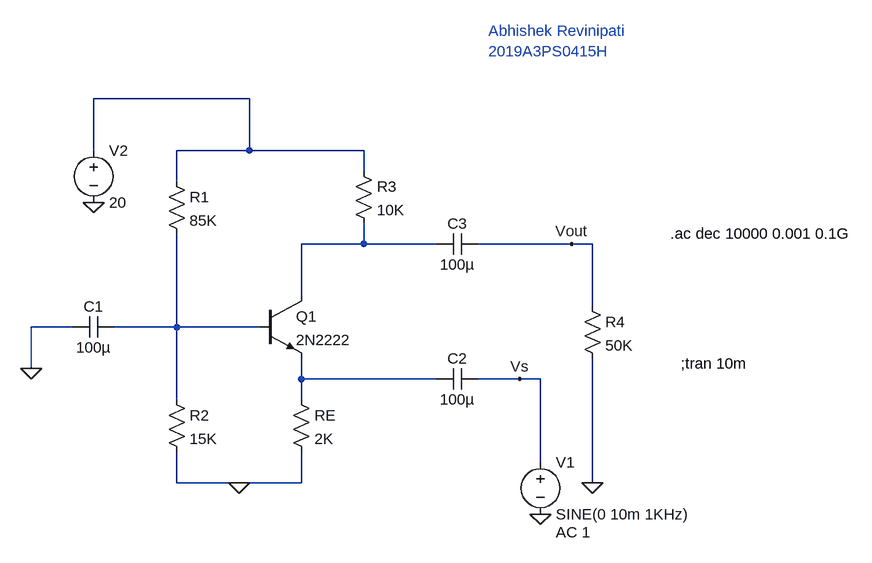
[diagram p0: schematic 2019A3PS0415H_CB_Amp.asc]
2019A3PS0415H_CB_Amp.asc, the LTspice schematic file:
Version 4
SHEET 1 1056 680
WIRE 112 -176 -128 -176
WIRE -128 -96 -128 -176
WIRE 112 -96 112 -176
WIRE 112 -96 0 -96
WIRE 288 -96 112 -96
WIRE 288 -64 288 -96
WIRE 0 -48 0 -96
WIRE 288 48 288 16
WIRE 288 48 192 48
WIRE 400 48 288 48
WIRE 608 48 464 48
WIRE 640 48 608 48
WIRE 192 128 192 48
WIRE 640 144 640 48
WIRE -160 176 -224 176
WIRE 0 176 0 32
WIRE 0 176 -96 176
WIRE 128 176 0 176
WIRE -224 240 -224 176
WIRE 192 256 192 224
WIRE 400 256 192 256
WIRE 528 256 464 256
WIRE 560 256 528 256
WIRE 0 288 0 176
WIRE 192 288 192 256
WIRE 560 384 560 256
WIRE 0 416 0 368
WIRE 96 416 0 416
WIRE 192 416 192 368
WIRE 192 416 96 416
WIRE 640 416 640 224
FLAG 96 416 0
FLAG -128 -16 0
FLAG 560 464 0
FLAG 640 416 0
FLAG -224 240 0
FLAG 528 256 Vs
FLAG 608 48 Vout
SYMBOL npn 128 128 R0
SYMATTR InstName Q1
SYMATTR Value 2N2222
SYMBOL res -16 -64 R0
SYMATTR InstName R1
SYMATTR Value 85K
SYMBOL res -16 272 R0
SYMATTR InstName R2
SYMATTR Value 15K
SYMBOL res 176 272 R0
SYMATTR InstName RE
SYMATTR Value 2K
SYMBOL cap -96 160 R90
WINDOW 0 0 32 VBottom 2
WINDOW 3 32 32 VTop 2
SYMATTR InstName C1
SYMATTR Value 100µ
SYMBOL cap 464 240 R90
WINDOW 0 0 32 VBottom 2
WINDOW 3 32 32 VTop 2
SYMATTR InstName C2
SYMATTR Value 100µ
SYMBOL cap 464 32 R90
WINDOW 0 0 32 VBottom 2
WINDOW 3 32 32 VTop 2
SYMATTR InstName C3
SYMATTR Value 100µ
SYMBOL res 624 128 R0
SYMATTR InstName R4
SYMATTR Value 50K
SYMBOL voltage 560 368 R0
WINDOW 123 24 124 Left 2
WINDOW 39 0 0 Left 2
SYMATTR Value2 AC 1
SYMATTR InstName V1
SYMATTR Value SINE(0 10m 1KHz)
SYMBOL voltage -128 -112 R0
WINDOW 123 0 0 Left 2
WINDOW 39 0 0 Left 2
SYMATTR InstName V2
SYMATTR Value 20
SYMBOL res 272 -80 R0
SYMATTR InstName R3
SYMATTR Value 10K
TEXT 776 232 Left 2 !;tran 10m
TEXT 760 32 Left 2 !.ac dec 10000 0.001 0.1G
TEXT 480 -280 Left 2 ;Abhishek Revinipati\n2019A3PS0415H

The netlist it stands for:
* 2019A3PS0415H_CB_Amp.asc
Q1 N002 N003 N004 0 2N2222
R1 N001 N003 85K
R2 N003 0 15K
RE N004 0 2K
C1 N003 0 100µ
C2 Vs N004 100µ
C3 Vout N002 100µ
R4 Vout 0 50K
V1 Vs 0 SINE(0 10m 1KHz) AC 1
V2 N001 0 20
R3 N001 N002 10K
.model NPN NPN
.model PNP PNP
.lib standard.bjt
;tran 10m
.ac dec 10000 0.001 0.1G
* Abhishek Revinipati
* 2019A3PS0415H
.backanno
.end